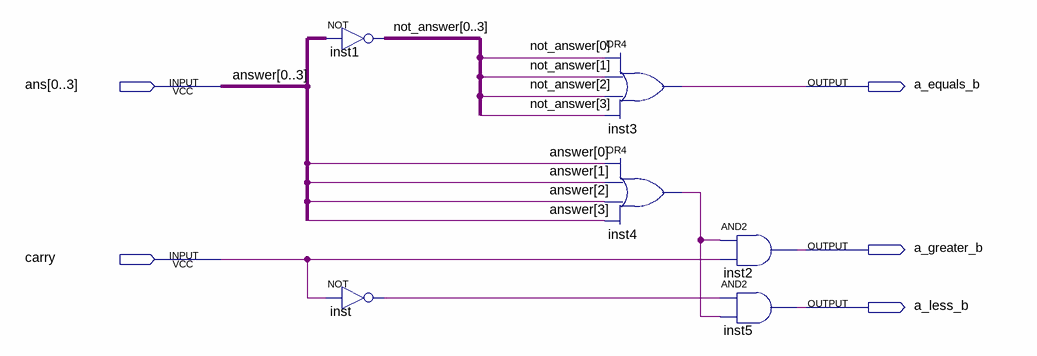
[diagram p0: schematic sheet]
// Quartus schematic compare_part.bdf as structural Verilog: 6 symbols, 5 pins
module compare_part (
  input  [0:3] ans,
  input  carry,
  output a_equals_b,
  output a_greater_b,
  output a_less_b
);

  wire inst4_out, inst_out;
  wire [3:0] not_answer;

  assign {not_answer[0], not_answer[1], not_answer[2], not_answer[3]} = ~ans;  // NOT inst1, 4 bits wide
  not inst (inst_out, carry);
  or inst3 (a_equals_b, not_answer[0], not_answer[1], not_answer[2], not_answer[3]);
  or inst4 (inst4_out, ans[0], ans[1], ans[2], ans[3]);
  and inst2 (a_greater_b, inst4_out, carry);
  and inst5 (a_less_b, inst_out, inst4_out);

  // Other names for the same wires on the sheet: answer[3:0] = {ans[3], ans[2], ans[1], ans[0]}
endmodule
